# EAGLE schematic esquematico_Erika (EAGLE 9.3.2)
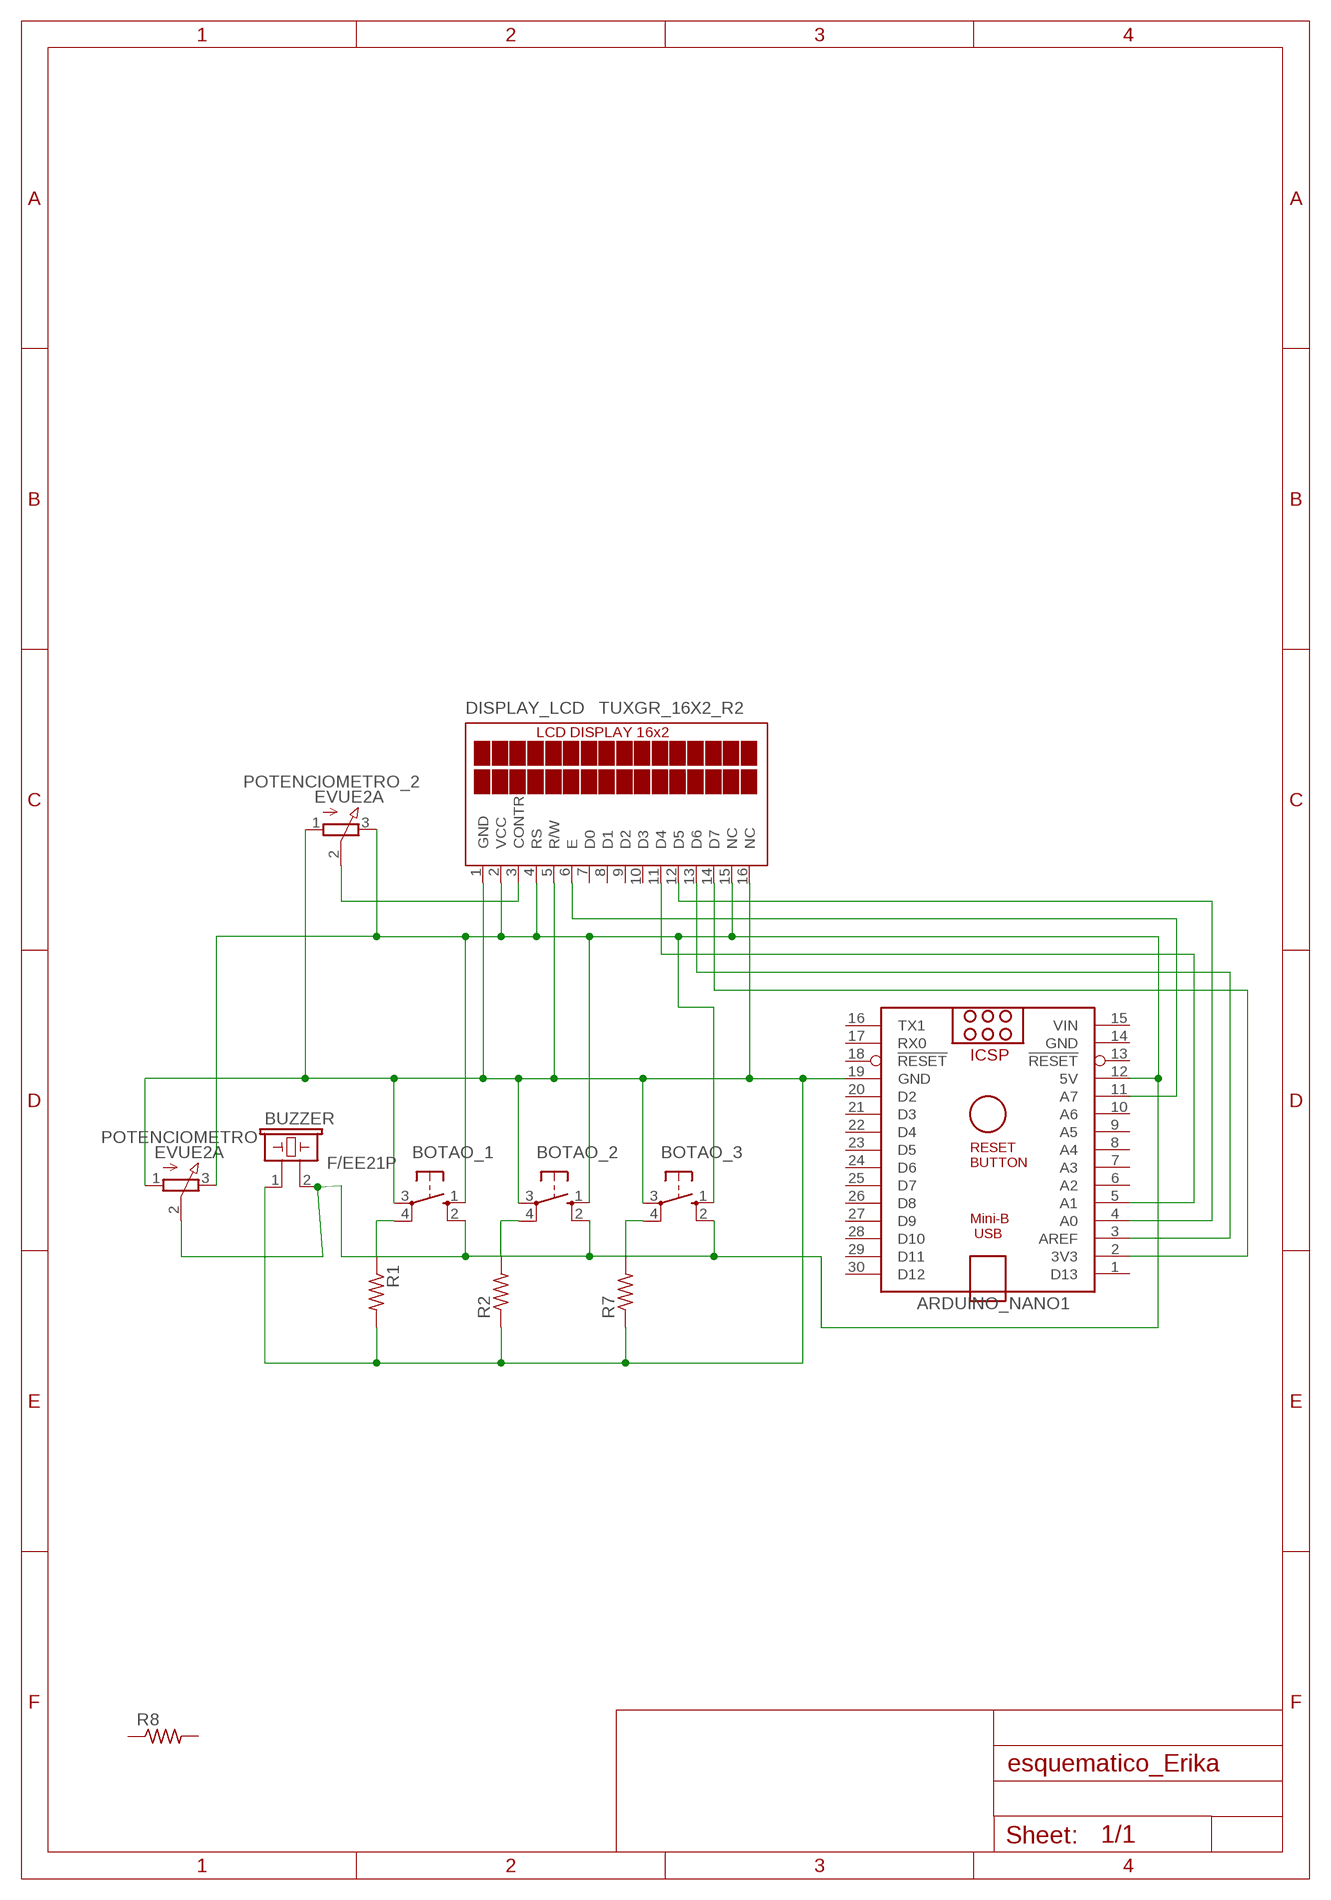
[diagram p0: schematic, sheet 1]

## Parts
ARDUINO_NANO1  ARDUINO_NANO  [ARDUINO_NANO]
BOTAO_1  10-XX  [B3F-10XX]
BOTAO_2  10-XX  [B3F-10XX]
BOTAO_3  10-XX  [B3F-10XX]
BUZZER  F/EE21P  [F/EE21P]
DISPLAY_LCD  TUXGR_16X2_R2  [TUXGR_16X2_R2]
POTENCIOMETRO  EVUE2A  [EVUE]
POTENCIOMETRO_2  EVUE2A  [EVUE]
R1  R-US_0204/7  [0204/7]
R2  R-US_0204/7  [0204/7]
R7  R-US_0204/7  [0204/7]
R8  R-US_0204/7  [0204/7]

## Nets
N$2: BOTAO_1.4(P1) R1.1
N$3: ARDUINO_NANO1.11(A7) DISPLAY_LCD.6(E)
N$4: ARDUINO_NANO1.5(A1) DISPLAY_LCD.11(D4)
N$5: ARDUINO_NANO1.4(A0) DISPLAY_LCD.12(D5)
N$6: ARDUINO_NANO1.3(AREF) DISPLAY_LCD.13(D6)
N$7: ARDUINO_NANO1.2(3V3) DISPLAY_LCD.14(D7)
N$8: BOTAO_2.4(P1) R2.2
N$9: ARDUINO_NANO1.12(5V) BOTAO_1.1(S) BOTAO_1.2(S1) BOTAO_2.1(S) BOTAO_2.2(S1) BOTAO_3.1(S) BOTAO_3.2(S1) BUZZER.2 DISPLAY_LCD.2(VCC) DISPLAY_LCD.4(RS) DISPLAY_LCD.15(NC) POTENCIOMETRO.2(S) POTENCIOMETRO.3(E) POTENCIOMETRO_2.3(E)
N$10: BOTAO_3.4(P1) R7.2
N$11: DISPLAY_LCD.3(CONTR) POTENCIOMETRO_2.2(S)
N$12: ARDUINO_NANO1.19(GND) BOTAO_1.3(P) BOTAO_2.3(P) BOTAO_3.3(P) BUZZER.1 DISPLAY_LCD.1(GND) DISPLAY_LCD.5(R/W) DISPLAY_LCD.16(NC) POTENCIOMETRO.1(A) POTENCIOMETRO_2.1(A) R1.2 R2.1 R7.1
Unconnected: ARDUINO_NANO1.1(D13) ARDUINO_NANO1.6(A2) ARDUINO_NANO1.7(A3) ARDUINO_NANO1.8(A4) ARDUINO_NANO1.9(A5) ARDUINO_NANO1.10(A6) ARDUINO_NANO1.13(!RESET) ARDUINO_NANO1.16(TX1) ARDUINO_NANO1.17(RX0) ARDUINO_NANO1.18(!RESET) ARDUINO_NANO1.20(D2) ARDUINO_NANO1.21(D3) ARDUINO_NANO1.22(D4) ARDUINO_NANO1.23(D5) ARDUINO_NANO1.24(D6) ARDUINO_NANO1.25(D7) ARDUINO_NANO1.26(D8) ARDUINO_NANO1.27(D9) ARDUINO_NANO1.28(D10) ARDUINO_NANO1.29(D11) ARDUINO_NANO1.30(D12) DISPLAY_LCD.7(D0) DISPLAY_LCD.8(D1) DISPLAY_LCD.9(D2) DISPLAY_LCD.10(D3) R8.1 R8.2

## Power pins joined to a net without a drawn wire
GND: ARDUINO_NANO1.14(GND)
VIN: ARDUINO_NANO1.15(VIN)

## Library data of the parts
ARDUINO_NANO1 = ArduinoNanoV30:ARDUINO_NANO: Arduino Nano V3.0 Overview: The Arduino Nano is a small, complete, and breadboard-friendly board based on the ATmega328 (Arduino Nano 3.x) or ATmega168 (Arduino Nano 2.x). It has more or less the same functionality of the Arduino Duemilanove, but in a different package. It lacks only a DC power jack, and works with a Mini-B USB cable instead of a standard one. The Nano was designed and is being produced by Gravitech. Specifications: Microcontroller Atmel ATmega168 or ATmega328 Operating Voltage (logic level) 5 V Input Voltage (recommended) 7-12 V Input Voltage (limits) 6-20 V Digital I/O Pins 14 (of which 6 provide PWM output) Analog Input Pins 8 DC Current per I/O Pin 40 mA Flash Memory 16 KB (ATmega168) or 32 KB (ATmega328) of which 2 KB used by bootloader SRAM 1 KB (ATmega168) or 2 KB (ATmega328) EEPROM 512 bytes (ATmega168) or 1 KB (ATmega328) Clock Speed 16 MHz Dimensions 0.73" x 1.70" Length 45 mm Width 18 mm Weigth 5 g Power: The Arduino Nano can be powered via the Mini-B USB connection, 6-20V unregulated external power supply (pin 30), or 5V regulated external power supply (pin 27). The power source is automatically selected to the highest voltage source. Memory: The ATmega168 has 16 KB of flash memory for storing code (of which 2 KB is used for the bootloader); the ATmega328 has 32 KB, (also with 2 KB used for the bootloader). The ATmega168 has 1 KB of SRAM and 512 bytes of EEPROM (which can be read and written with the EEPROM library); the ATmega328 has 2 KB of SRAM and 1 KB of EEPROM. Input and Output: Each of the 14 digital pins on the Nano can be used as an input or output, using pinMode(), digitalWrite(), and digitalRead() functions. They operate at 5 volts. Each pin can provide or receive a maximum of 40 mA and has an internal pull-up resistor (disconnected by default) of 20-50 kOhms. In addition, some pins have specialized functions. Visit Arduino - ArduinoBoardNano <https://www.arduino.cc/en/Main/ArduinoBoardNano>
BOTAO_1-BOTAO_3 = switch-omron:10-XX: OMRON SWITCH; MPN: B3F-1000; OC_FARNELL: 176432; OC_NEWARK: 36M3542
BUZZER = buzzer:F/EE21P: BUZZER Source: Buerklin; OC_FARNELL: unknown; OC_NEWARK: unknown
DISPLAY_LCD = display-lcd:TUXGR_16X2_R2: Tuxgraphics LCD display 16x2 characters reflective, without background light Source: tuxgr_12x2_r2.pdf; OC_FARNELL: unknown; OC_NEWARK: unknown
POTENCIOMETRO POTENCIOMETRO_2 = pot:EVU: 9 mm Square Rotary Potentiometers Source: Panasonic
R1 R2 R7 R8 = rcl:R-US_: RESISTOR, American symbol; SPICEPREFIX: R